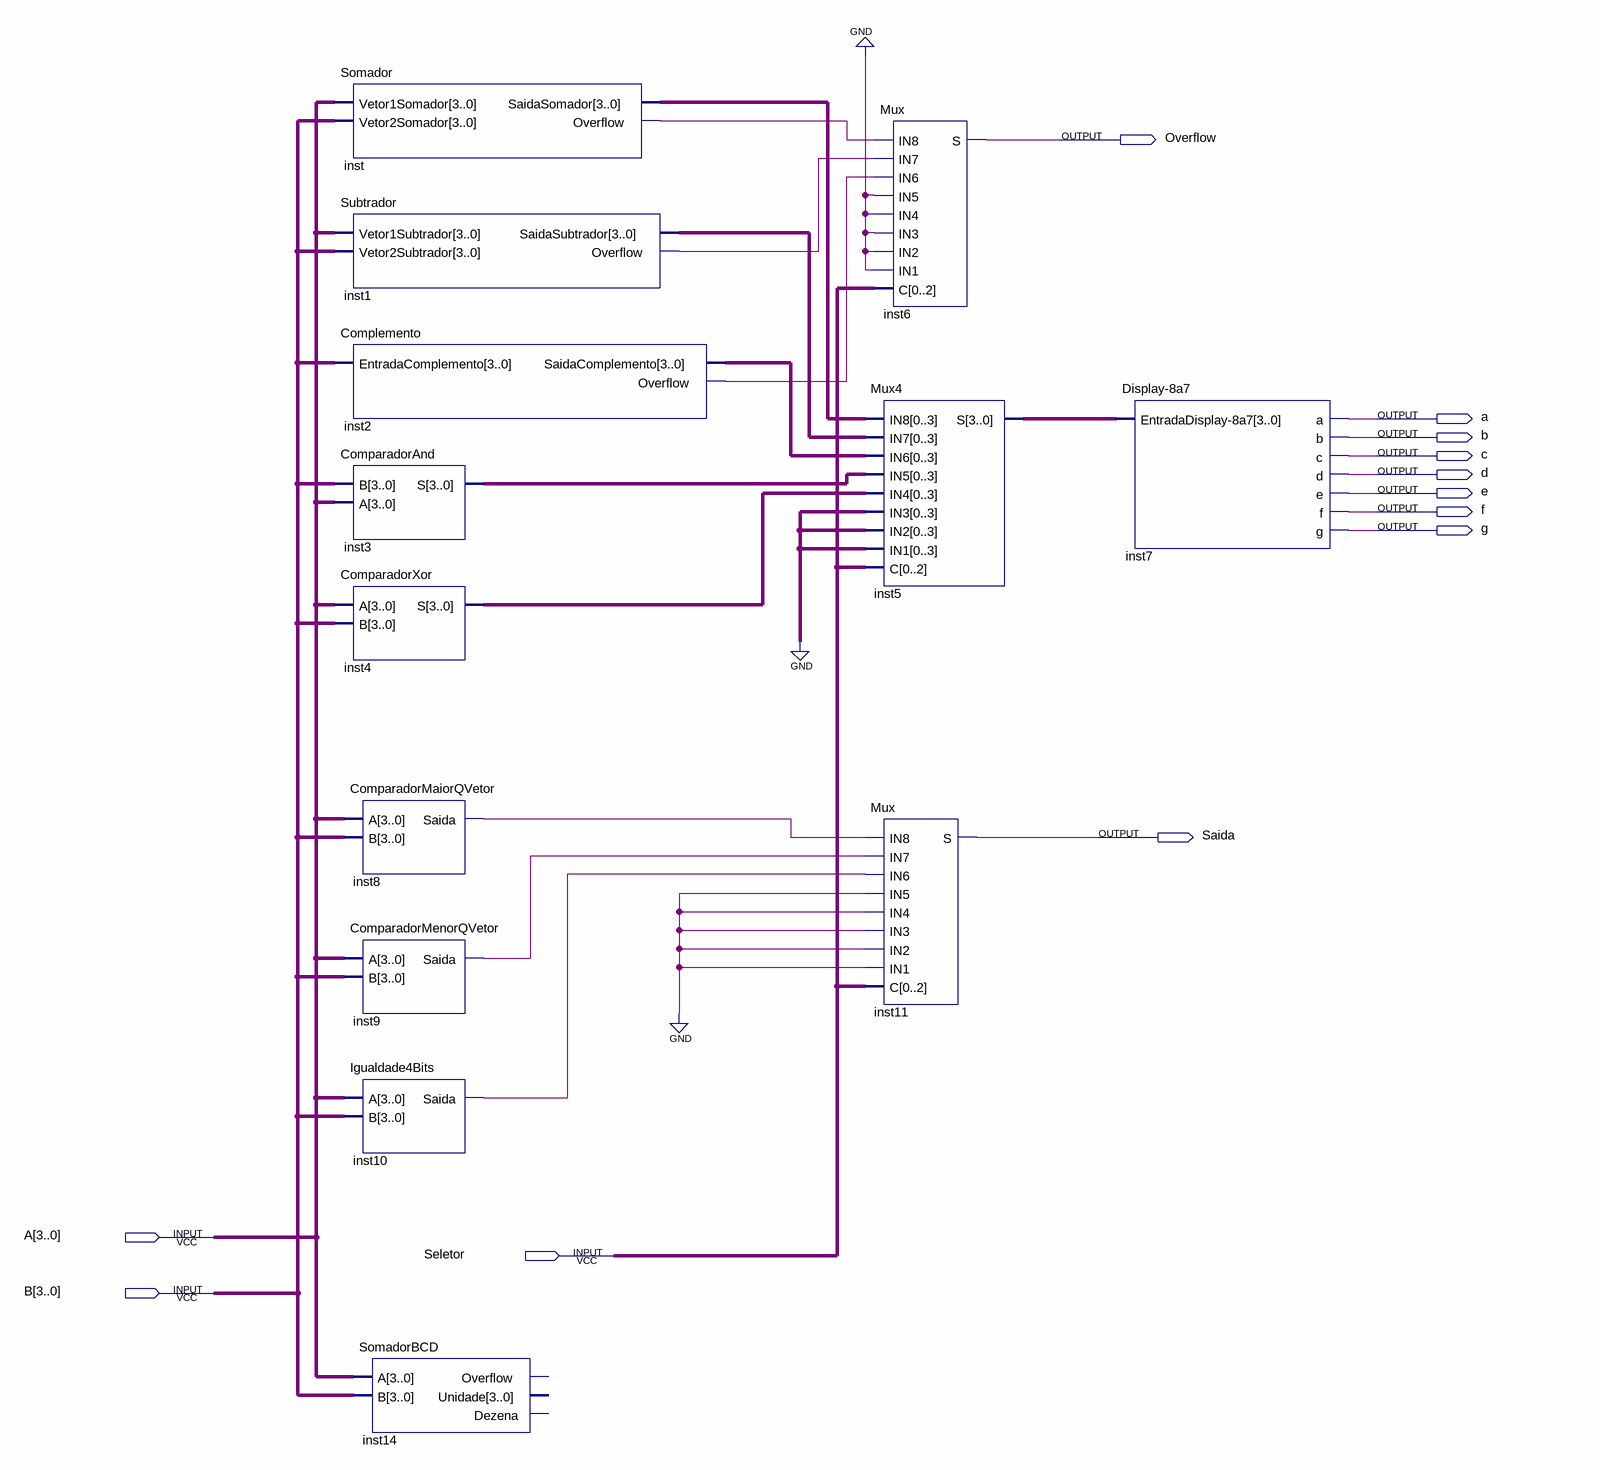
[diagram p0: schematic sheet]
// Quartus schematic ProjetoSD.bdf as structural Verilog: 13 symbols, 12 pins
module ProjetoSD (
  input  [3:0] A,
  input  Seletor,
  input  [3:0] B,
  output Overflow,
  output A_1bit,
  output B_1bit,
  output c,
  output d,
  output e,
  output f,
  output g,
  output Saida
);

  wire inst1_overflow, inst2_overflow, inst8_saida, inst9_saida, inst10_saida, inst_overflow;
  wire [2:0] undriven;
  wire [3:0] inst1_saidasubtrador, inst2_saidacomplemento, inst3_s, inst4_s, inst5_s, inst_saidasomador;

  Somador inst (.Vetor1Somador(A), .Vetor2Somador(B), .SaidaSomador(inst_saidasomador), .Overflow(inst_overflow));
  Subtrador inst1 (
    .Vetor1Subtrador(A), .Vetor2Subtrador(B), .SaidaSubtrador(inst1_saidasubtrador), .Overflow(inst1_overflow));
  Complemento inst2 (.EntradaComplemento(B), .SaidaComplemento(inst2_saidacomplemento), .Overflow(inst2_overflow));
  ComparadorAnd inst3 (.B(B), .A(A), .S(inst3_s));
  ComparadorXor inst4 (.A(A), .B(B), .S(inst4_s));
  ComparadorMaiorQVetor inst8 (.A(A), .B(B), .Saida(inst8_saida));
  ComparadorMenorQVetor inst9 (.A(A), .B(B), .Saida(inst9_saida));
  Igualdade4Bits inst10 (.A(A), .B(B), .Saida(inst10_saida));
  SomadorBCD inst14 (.A(A), .B(B));  // open: Overflow, Unidade, Dezena
  Mux inst6 (
    .IN8(inst_overflow), .IN7(inst1_overflow), .IN6(inst2_overflow), .IN5(1'b0), .IN4(1'b0), .IN3(1'b0),
    .IN2(1'b0), .IN1(1'b0), .C(undriven), .S(Overflow));
  Mux4 inst5 (
    .IN8(inst_saidasomador), .IN7(inst1_saidasubtrador), .IN6(inst2_saidacomplemento), .IN5(inst3_s),
    .IN4(inst4_s), .IN3(4'b0000), .IN2(4'b0000), .IN1(4'b0000), .C(undriven), .S(inst5_s));
  Mux inst11 (
    .IN8(inst8_saida), .IN7(inst9_saida), .IN6(inst10_saida), .IN5(1'b0), .IN4(1'b0), .IN3(1'b0), .IN2(1'b0),
    .IN1(1'b0), .C(undriven), .S(Saida));
  \Display-8a7  inst7 (.\EntradaDisplay-8a7 (inst5_s), .a(A_1bit), .b(B_1bit), .c(c), .d(d), .e(e), .f(f), .g(g));
endmodule
